# Altium schematic sheet Main.SchDoc
size A4
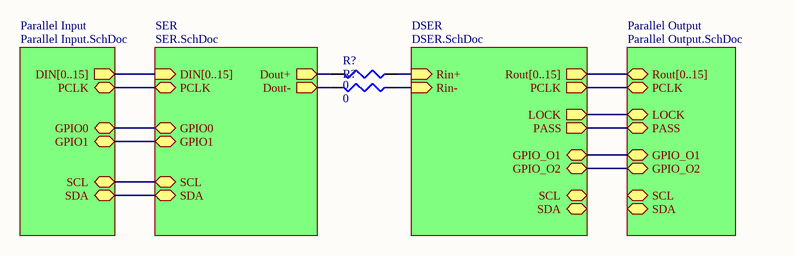
[diagram p0: Main.SchDoc]

## Parts
(Parts that share a designator on the sheet are numbered #1, #2 ... from top to bottom, then left to right.)
R?#1  value 0  [12Z-2010]  (hidden comment: Res3)
R?#2  value 0  [12Z-2010]  (hidden comment: Res3)

## Sub-sheets
DSER = DSER.SchDoc: Rout[0..15] (out), Rin+ (in), Rin- (in), GPIO_O1, GPIO_O2, PCLK (out), LOCK (out), PASS (out), SCL, SDA
Parallel Input = Parallel Input.SchDoc: DIN[0..15] (out), SCL, SDA, PCLK, GPIO0, GPIO1
Parallel Output = Parallel Output.SchDoc: Rout[0..15], PCLK, GPIO_O1, GPIO_O2, LOCK, PASS, SCL, SDA
SER = SER.SchDoc: DIN[0..15] (in), Dout+ (out), Dout- (out), GPIO0, GPIO1, SCL, SDA, PCLK

## Nets
NetR?#1_1: R?#1.1 ; sheet DSER/Rin+
NetR?#1_2: R?#1.2 ; sheet SER/Dout+
NetR?#2_1: R?#2.1 ; sheet DSER/Rin-
NetR?#2_2: R?#2.2 ; sheet SER/Dout-
(unnamed): sheet SER/GPIO0, sheet Parallel Input/GPIO0
(unnamed): sheet SER/GPIO1, sheet Parallel Input/GPIO1
(unnamed): sheet SER/SCL, sheet Parallel Input/SCL
(unnamed): sheet SER/SDA, sheet Parallel Input/SDA
(unnamed): sheet SER/PCLK, sheet Parallel Input/PCLK
(unnamed): sheet DSER/GPIO_O1, sheet Parallel Output/GPIO_O1
(unnamed): sheet DSER/GPIO_O2, sheet Parallel Output/GPIO_O2
(unnamed): sheet DSER/PCLK, sheet Parallel Output/PCLK
(unnamed): sheet DSER/LOCK, sheet Parallel Output/LOCK
(unnamed): sheet DSER/PASS, sheet Parallel Output/PASS

## Buses and harness runs
bus sheet DSER/Rout[0..15] = sheet Parallel Output/Rout[0..15]
bus sheet Parallel Input/DIN[0..15] = sheet SER/DIN[0..15]

## Library data of the parts
R?#1 R?#2 = Res3: Resistor; Published: 8-Jun-2000; LatestRevisionDate: 29-May-2009; LatestRevisionNote: IPC-7351 Footprint Added.; PackageReference: J1-0603; Publisher: Altium Limited; PackageDescription: Chip Resistor